# EAGLE design esquema v1 (EAGLE 9.6.2)
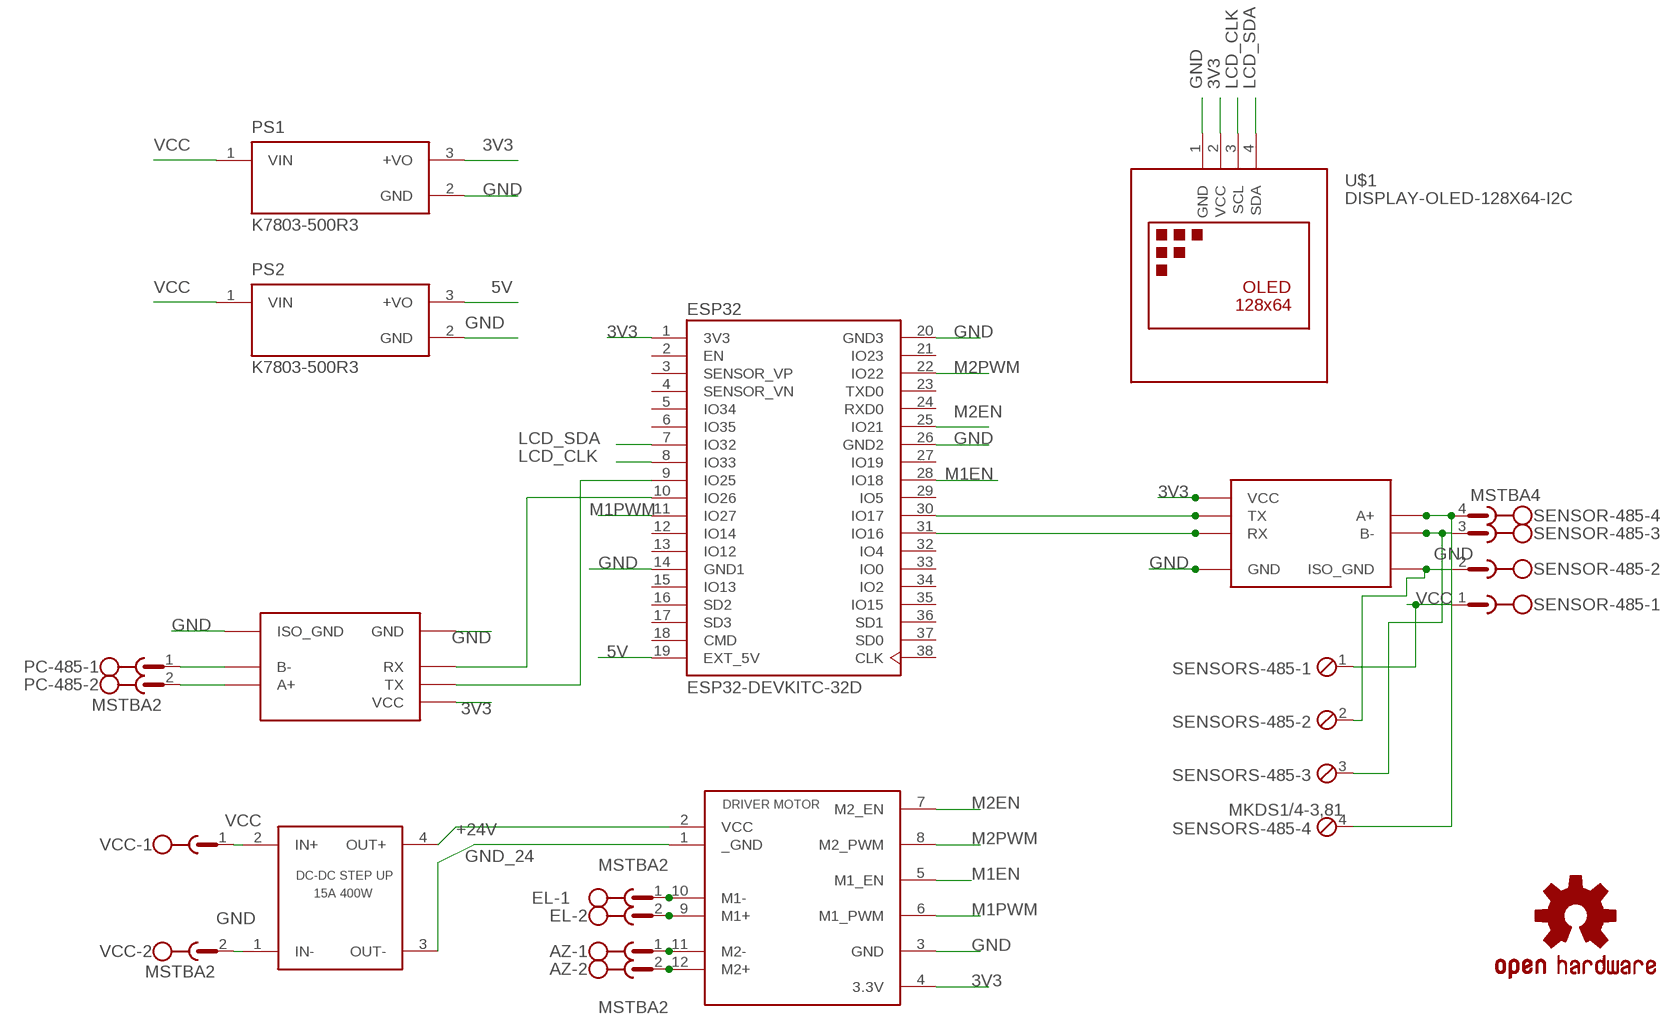
[diagram p0: schematic, sheet 1]

## Parts
AZ  MSTBA2  [MSTBA2]
EL  MSTBA2  [MSTBA2]
ESP32  ESP32-DEVKITC-32D  [MODULE_ESP32-DEVKITC-32D]
LOGO1  OSHW-LOGOMINI  [OSHW-LOGO-MINI]
M1  DRIVER_MOTOR  [DRIVER_MOTOR]
M2  DC-DC_STRP_UP  [DC-DC-SETP-UP]
M3  LIMNOTECH_SMC_RS485  [LIMNOTECH_SMC_RS485]
M4  LIMNOTECH_SMC_RS485  [LIMNOTECH_SMC_RS485]
PC-485  MSTBA2  [MSTBA2]
PS1  K7803-500R3  [CONV_K7803-500R3]
PS2  K7803-500R3  [CONV_K7803-500R3]
SENSOR-485  MSTBA4  [MSTBA4]
SENSORS-485  MKDS1/4-3,81  [4POL381]
U$1  DISPLAY-OLED-128X64-I2C  [DISPLAY-OLED-128X64-I2C]
VCC  MSTBA2  [MSTBA2]

## Nets
3V3: ESP32.1(3V3) M1.4(3.3V) M3.VCC M4.VCC PS1.3(+VO) U$1.2(VCC)
5V: ESP32.19(EXT_5V) PS2.3(+VO)
+24V: M1.2(VCC) M2.4(OUT+)
GND: ESP32.14(GND1) ESP32.20(GND3) ESP32.26(GND2) M1.3(GND) M2.1(IN-) M3.GND M3.GND_ISO(ISO_GND) M4.GND M4.GND_ISO(ISO_GND) PS1.2(GND) PS2.2(GND) SENSOR-485.2 SENSORS-485.2 U$1.1(GND) VCC.2
GND_24: M1.1(_GND) M2.3(OUT-)
LCD_CLK: ESP32.8(IO33) U$1.3(SCL)
LCD_SDA: ESP32.7(IO32) U$1.4(SDA)
M1EN: ESP32.28(IO18) M1.5(M1_EN)
M1PWM: ESP32.11(IO27) M1.6(M1_PWM)
M2EN: ESP32.25(IO21) M1.7(M2_EN)
M2PWM: ESP32.22(IO22) M1.8(M2_PWM)
N$1: M4.B- SENSOR-485.3 SENSORS-485.3
N$2: M4.A+ SENSOR-485.4 SENSORS-485.4
N$3: EL.2 M1.9(M1+)
N$4: AZ.2 M1.12(M2+)
N$5: ESP32.10(IO26) M3.RX
N$6: ESP32.9(IO25) M3.TX
N$7: ESP32.31(IO16) M4.RX
N$8: ESP32.30(IO17) M4.TX
N$9: M3.B- PC-485.1
N$10: M3.A+ PC-485.2
N$11: AZ.1 M1.11(M2-)
N$12: EL.1 M1.10(M1-)
VCC [power]: M2.2(IN+) PS1.1(VIN) PS2.1(VIN) SENSOR-485.1 SENSORS-485.1 VCC.1
Unconnected: ESP32.2(EN) ESP32.3(SENSOR_VP) ESP32.4(SENSOR_VN) ESP32.5(IO34) ESP32.6(IO35) ESP32.12(IO14) ESP32.13(IO12) ESP32.15(IO13) ESP32.16(SD2) ESP32.17(SD3) ESP32.18(CMD) ESP32.21(IO23) ESP32.23(TXD0) ESP32.24(RXD0) ESP32.27(IO19) ESP32.29(IO5) ESP32.32(IO4) ESP32.33(IO0) ESP32.34(IO2) ESP32.35(IO15) ESP32.36(SD1) ESP32.37(SD0) ESP32.38(CLK)

## Library data of the parts
AZ EL PC-485 VCC = con-phoenix-508:MSTBA2: PHOENIX; MF: FARNELL; MPN: 1757242; OC_FARNELL: 3705171; OC_NEWARK: 71C4161
ESP32 = ESP32-DEVKITC-32D:ESP32-DEVKITC-32D: Eval Board For Esp-Wroom-32 Check prices <https://pricing.snapeda.com/parts/ESP32-DEVKITC-32D/Espressif%20Systems/view-part?ref=eda>; AVAILABILITY: Warning; DESCRIPTION: EVAL BOARD FOR ESP-WROOM-32; MF: Espressif Systems; MP: ESP32-DEVKITC-32D; PACKAGE: None; PRICE: None; PURCHASE-URL: https://pricing.snapeda.com/search/part/ESP32-DEVKITC-32D/?ref=eda
LOGO1 = SparkFun-Aesthetics:OSHW-LOGO: Open-Source Hardware (OSHW) Logo This logo indicates the piece of hardware it is found on incorporates a OSHW license and/or adheres to the definition of open source hardware found here: http://freedomdefined.org/OSHW
M1 = aamilibreria:DRIVER_MOTOR
M2 = aamilibreria:DC-DC_STRP_UP
M3 M4 = aamilibreria:LIMNOTECH_SMC_RS485: Layout for connecting SMC RS-485 module Module <https://www.amazon.com/SMAKN%C2%AE-Adapter-Serial-Converter-Module/dp/B010723BCE>
PS1 PS2 = K7803-500R3:K7803-500R3: DC/DC Converter Check availability <https://pricing.snapeda.com/parts/K7803-500R3/Mornsun%20America%2C%20LLC/view-part?ref=eda>; AVAILABILITY: In Stock; DESCRIPTION: Non-Isolated PoL Module DC DC Converter 1 Output 3.3V, -3.3V - - - 500mA, 300mA 4.75V, 7V - 36V, 32V Input; MF: Mornsun America, LLC; MP: K7803-500R3; PACKAGE: SIP-3-3 MORNSUN; PRICE: None; PURCHASE-URL: https://pricing.snapeda.com/search/part/K7803-500R3/?ref=eda
SENSOR-485 = con-phoenix-508:MSTBA4: PHOENIX; MF: FARNELL; MPN: 1757268; OC_FARNELL: 3705195; OC_NEWARK: 71C4163
SENSORS-485 = con-phoenix-381:MKDS1/4-3,81: MKDS 1/4-3,81 - Order No. 1727036 Pitch: 3,81mm Number of terminals: 4 Rated Voltage: 160V Maximum load current/ cross section: 12A/1.5mm2-AWG16 Housing Interlocking: none Color: Green
U$1 = diy-modules:DISPLAY-OLED-128X64-I2C: 128x64 Dot Matrix OLED Module based on SSD1306 chip Variant with I2C interface More details available here: http://www.instructables.com/id/Monochrome-096-i2c-OLED-display-with-arduino-SSD13/ SSD1306 datasheet: https://cdn-shop.adafruit.com/datasheets/SSD1306.pdf Click here to find device on ebay.com <http://www.ebay.com/sch/oled+display+128x64+iic> Note: There are two variants: I2C and SPI. Search for the proper version.

## Net classes
0 default: width 0.5 mm, drill 0.5 mm, clearance 0.8 mm
1 power: width 1 mm, clearance 1 mm

## Board
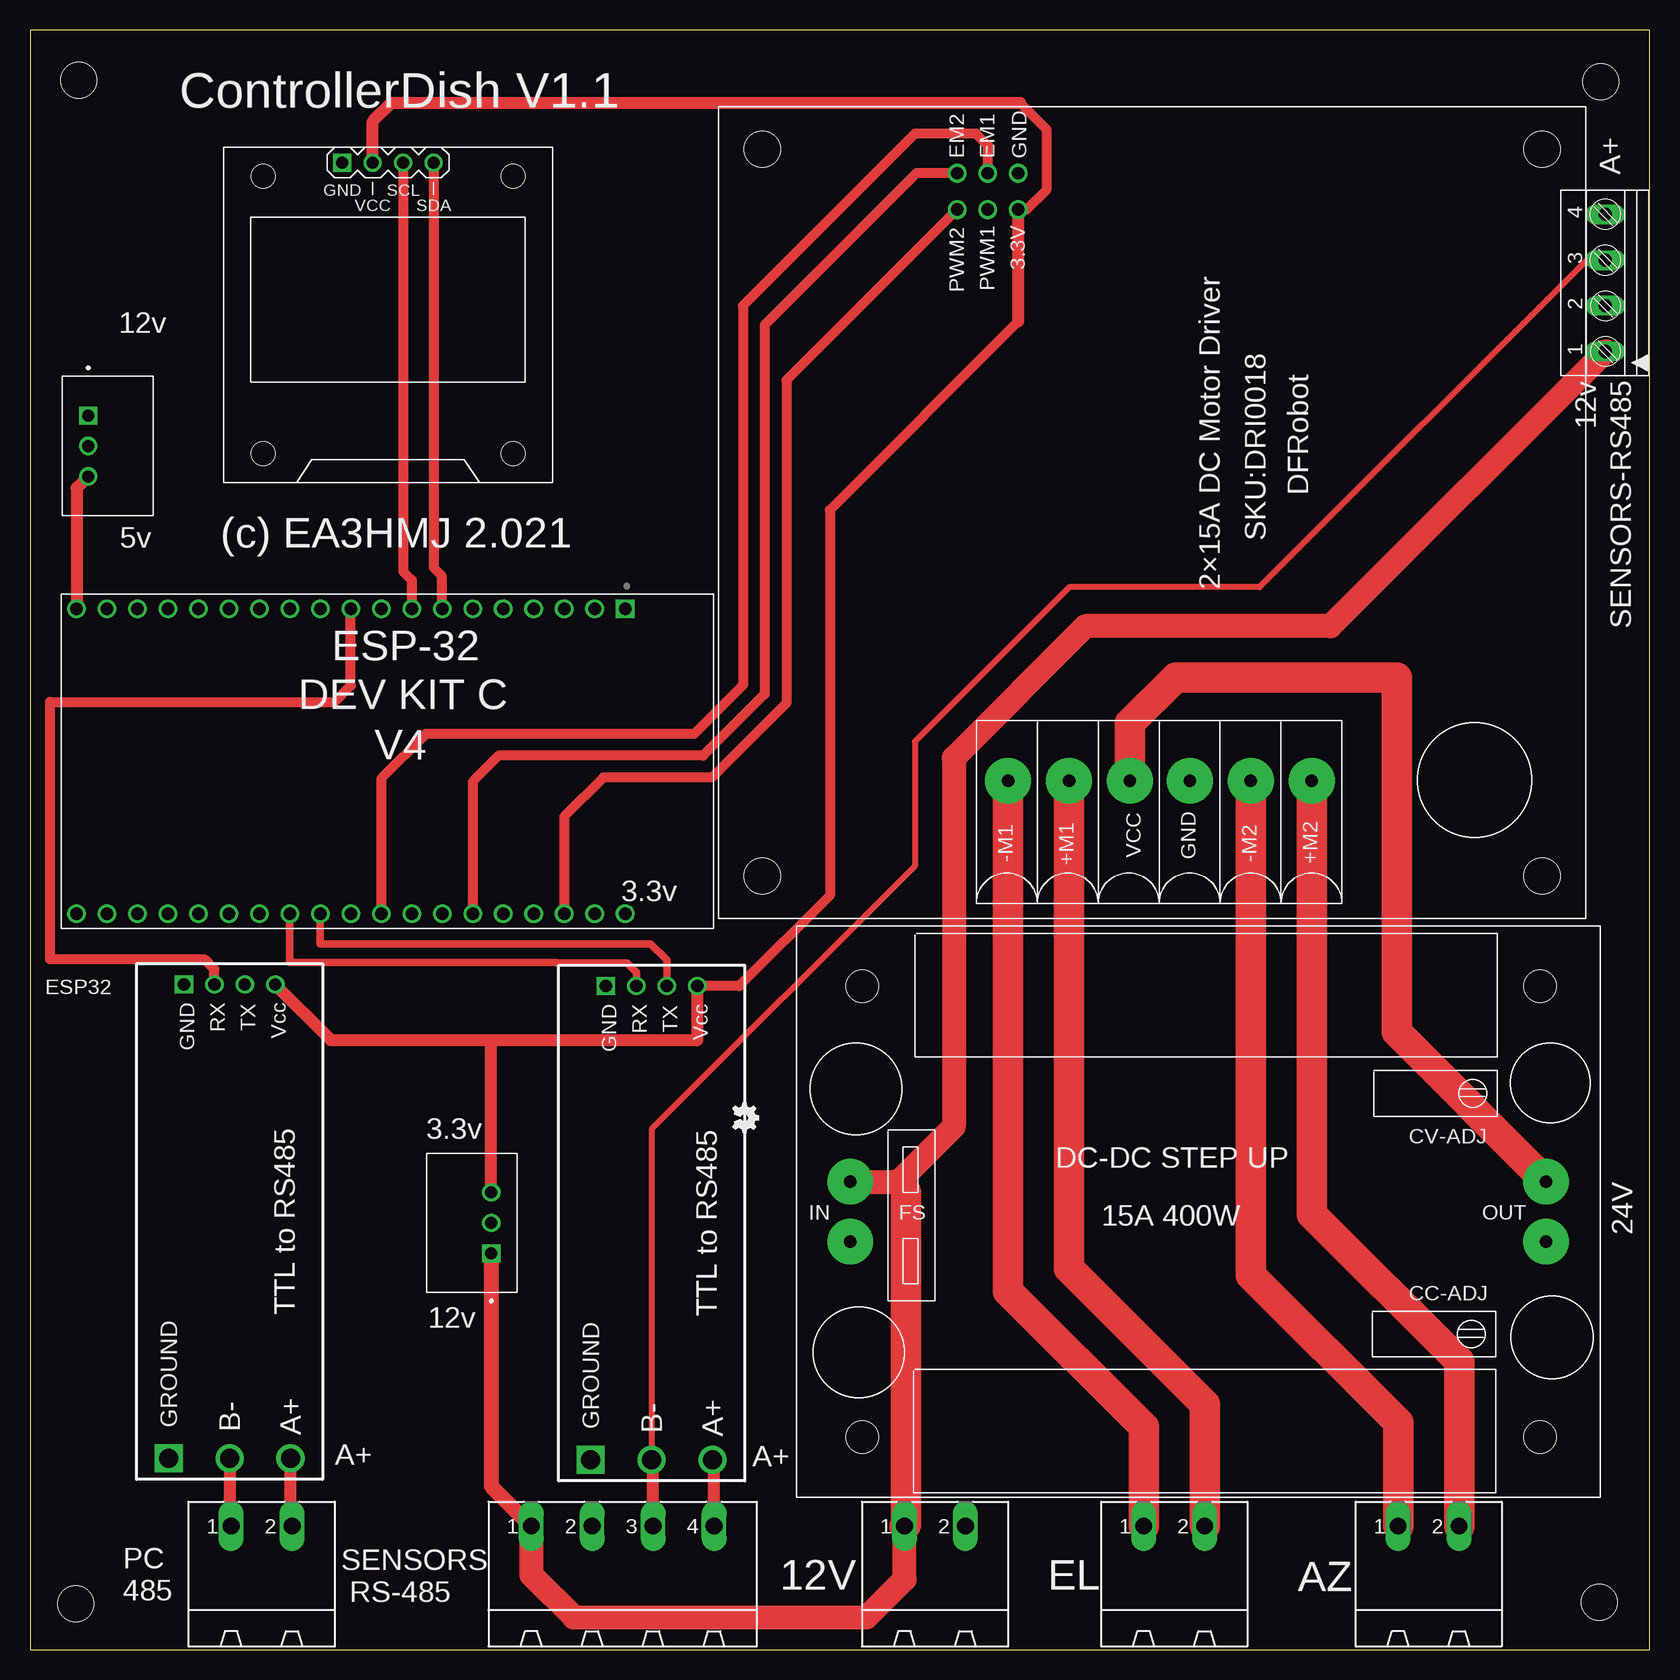
[diagram p1: board, top side]
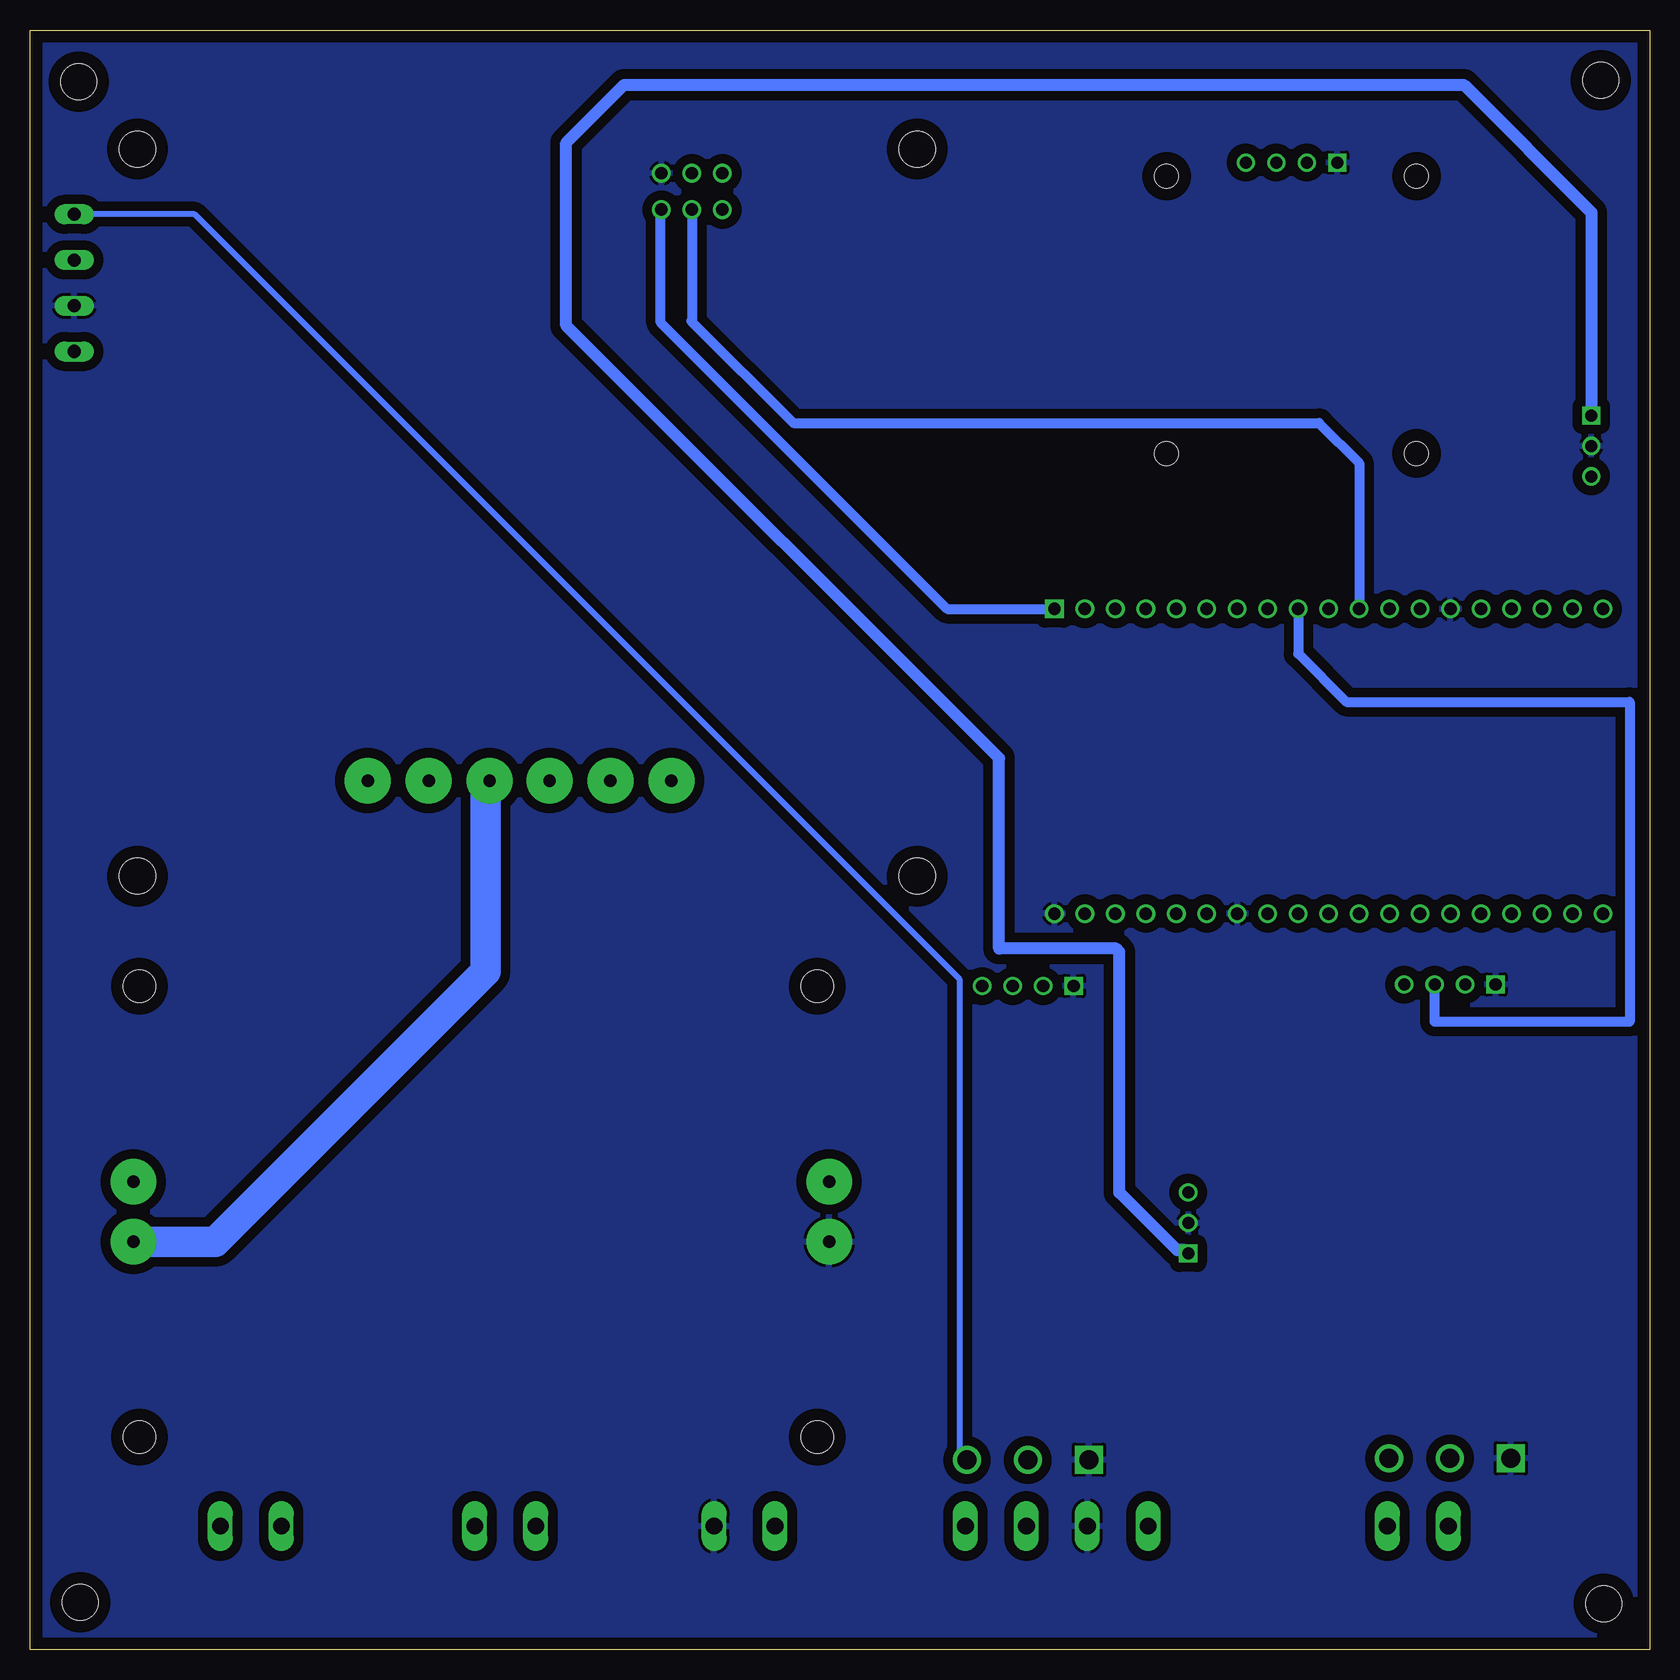
[diagram p2: board, bottom side, seen from below]

Size 135 x 135 mm. Coordinates in mm from the lower left corner, seen from the top.
Outline: 0,135 0,0 135,0 135,135 0,135
Copper layers (1*16): Top 0.035mm / dielectric 1.5mm / Bottom 0.035mm
Design rules "default": minimum track width 6mil, minimum drill 0.35mm, track to track 6mil, track to pad 6mil, pad to pad 6mil, via to via 6mil, smd to smd 6mil, copper to edge 40mil, drill to drill 6mil, minimum pad ring 10mil, minimum via ring 8mil, stop-mask expansion 4mil, vias tented up to drill 0mil, thermal gap 10mil
Holes 3 mm at 3.81,3.81 4.06,130.81 130.81,3.94 130.94,130.68

### Footprints (pad centres in the part's own frame; a part is rotated, then mirrored left to right if it is on the bottom)
MSTBA2 = drill 1.397 long: 1 -2.54,5.08; 2 2.54,5.08
MODULE_ESP32-DEVKITC-32D = drill 1.04 square: 1 -12.7,19.76 | drill 1.04: 2 -12.7,17.22; 3 -12.7,14.68; 4 -12.7,12.14; 5 -12.7,9.6; 6 -12.7,7.06; 7 -12.7,4.52; 8 -12.7,1.98; 9 -12.7,-0.56; 10 -12.7,-3.1; 11 -12.7,-5.64; 12 -12.7,-8.18; 13 -12.7,-10.72; 14 -12.7,-13.26; 15 -12.7,-15.8; 16 -12.7,-18.34; 17 -12.7,-20.88; 18 -12.7,-23.42; 19 -12.7,-25.96; 20 12.7,19.76; 21 12.7,17.22; 22 12.7,14.68; 23 12.7,12.14; 24 12.7,9.6; 25 12.7,7.06; 26 12.7,4.52; 27 12.7,1.98; 28 12.7,-0.56; 29 12.7,-3.1; 30 12.7,-5.64; 31 12.7,-8.18; 32 12.7,-10.72; 33 12.7,-13.26; 34 12.7,-15.8; 35 12.7,-18.34; 36 12.7,-20.88; 37 12.7,-23.42; 38 12.7,-25.96
DRIVER_MOTOR = drill 1.04 pad 3.81: 1 11.5,33; 2 11.5,38; 9 11.5,43.08; 10 11.5,48.16; 11 11.5,27.92; 12 11.5,22.84 | drill 1.04: 3 62.14,47.32; 4 59.1,47.32; 5 62.14,49.86; 6 59.1,49.86; 7 62.14,52.4; 8 59.1,52.4 | hole 3: 3.55,68.65; 64.15,68.65; 64.15,3.65; 3.55,3.65
DC-DC-SETP-UP = drill 1.04 pad 3.81: 1 4.5,21.3; 2 4.5,26.3; 3 62.5,21.3; 4 62.5,26.3 | hole 2.7: 5.5,5; 5.5,42.6; 62,42.6; 62,5
LIMNOTECH_SMC_RS485 = drill 1.57: A+ 19.75,5.08; B- 19.75,0 | drill 1.016 square: GND -19.75,-3.81 | drill 1.57 square: GND_ISO 19.75,-5.08 | drill 1.016: RX -19.75,-1.27; TX -19.75,1.27; VCC -19.75,3.81
CONV_K7803-500R3 = drill 1 square: 1 -2.54,-1.625 | drill 1: 2 0,-1.625; 3 2.54,-1.625
MSTBA4 = drill 1.397 long: 1 -7.62,5.08; 2 -2.54,5.08; 3 2.54,5.08; 4 7.62,5.08
4POL381 = drill 1.1 long: 1 0,0; 2 3.81,0; 3 7.62,0; 4 11.43,0
DISPLAY-OLED-128X64-I2C = drill 1 square: 1 -3.81,12.7 | drill 1: 2 -1.27,12.7; 3 1.27,12.7; 4 3.81,12.7 | hole 2: -10.414,11.557; 10.414,11.557; 10.414,-11.557; -10.414,-11.557

### Placement (x,y rotation side)
AZ  116.59,5.21 0 top
EL  95.38,5.21 0 top
ESP32  29.84,74.04 270 top
LOGO1  59.56,44.32 270 top
M1  129.69,60.92 90 top
M2  63.88,12.7 0 top
M3  16.64,35.69 270 top
M4  51.82,35.56 270 top
PC-485  19.3,5.21 0 top
PS1  36.83,35.56 90 top
PS2  6.48,100.33 270 top
SENSOR-485  49.4,5.21 0 top
SENSORS-485  131.32,108.2 90 top
U$1  29.84,111.25 0 top
VCC  75.44,5.21 0 top

### Tracks (layer width: path | path; a pad name or v marks a point on that pad's centre or on a via)
3V3
  Top 0.813: 82.37,110.69 66.67,95 66.67,62.87 59.12,55.31 M4.VCC | 82.55,128.91 84.71,126.75 84.71,121.67 83.07,120.02 M1.4
  Top 1.016: M4.VCC 55.63,50.8 38.45,50.8 | M3.VCC 25.08,50.8 38.45,50.8 | M1.4 82.37,110.69 | 82.55,128.91 30.1,128.91 28.57,127.38 U$1.2 | PS1.3 38.45,50.8
  Bottom 0.813: ESP32.1 58.55,86.74 82.42,110.62 82.42,119.97 M1.4
5V
  Top 1.016: PS2.3 3.88,96.82 ESP32.19
+24V
  Top 2.54: M2.4 113.92,51.46 113.92,81.03 95.5,81.03 91.69,77.21 M1.2
GND
  pour Bottom: -1.27,141.35 140.21,141.35 140.21,0.13 -1.27,0.13
GND_24
  Bottom 2.54: M2.3 119.54,34 97.03,56.52 97.03,72.08 M1.1
LCD_CLK
  Top 0.813: U$1.3 31.11,89.87 31.82,89.15 ESP32.8
LCD_SDA
  Top 0.813: ESP32.7 34.3,86.81 34.3,89.53 33.66,90.17 U$1.4
M1EN
  Top 0.813: M1.5 79.85,123.09 79.85,125.37 78.86,126.36 73.79,126.36 59.44,112.01 59.44,80.39 55.37,76.33 33.02,76.33 29.29,72.59 ESP32.28
M1PWM
  Bottom 0.813: M1.6 79.83,110.8 79.88,110.74 71.37,102.23 27.56,102.23 24.2,98.88 ESP32.11
M2EN
  Top 0.813: M1.7 73.91,123.06 61.25,110.4 61.25,79.64 56.12,74.51 39.08,74.51 36.91,72.34 ESP32.25
M2PWM
  Top 0.813: M1.8 63.06,105.8 63.06,78.89 56.87,72.7 47.81,72.7 44.52,69.42 ESP32.22
N$1
  Top 0.5: M4.B- 51.82,43.38 73.75,65.32 73.75,75.67 86.62,88.55 102.5,88.55 129.77,115.82 SENSORS-485.3
  Top 1.016: SENSOR-485.3 51.94,15.68 M4.B-
N$2
  Top 1.016: SENSOR-485.4 57.02,15.68 M4.A+
  Bottom 0.5: M4.A+ 57.53,16.45 57.53,55.88 121.28,119.63 SENSORS-485.4
N$3
  Top 2.54: M1.9 86.61,31.76 97.92,20.45 EL.2
N$4
  Top 2.54: M1.12 106.85,36.28 119.13,24 AZ.2
N$5
  Top 0.813: M3.RX 15.37,56.71 14.54,57.53 1.68,57.53 1.68,78.99 25.4,78.99 26.75,80.34 ESP32.10
N$6
  Bottom 0.813: ESP32.9 29.29,83.01 25.27,78.99 1.65,78.99 1.65,52.32 17.91,52.32 M3.TX
N$7
  Top 0.61: M4.RX 50.55,56.45 49.78,57.22 43.88,57.22 43.81,57.28 21.66,57.28 ESP32.31
N$8
  Top 0.61: ESP32.30 24.2,58.81 51.74,58.81 53.09,57.47 M4.TX
N$9
  Top 1.016: M3.B- 16.64,10.41 PC-485.1
N$10
  Top 1.016: PC-485.2 21.72,10.41 M3.A+
N$11
  Top 2.54: M1.11 101.77,31.2 114.05,18.92 AZ.1
N$12
  Top 2.54: M1.10 81.53,29.85 92.84,18.54 EL.1
VCC
  Top 1.27: PS1.1 38.45,13.62 SENSOR-485.1
  Top 2: SENSORS-485.1 108.41,85.3 87.97,85.3 77,74.33 77,43.6 72.26,38.86 | SENSOR-485.1 41.78,6.22 45.34,2.67 69.72,2.67 72.9,5.84 VCC.1 | 73.03,38.1 72.26,38.86 | M2.2 72.12,39 72.26,38.86
  Top 2.54: 73.03,38.1 73.03,10.41 VCC.1
  Bottom 1.016: PS1.1 38.73,33.3 39.39,33.3 44.2,38.1 44.2,58.17 44.45,58.42 54.23,58.42 54.23,74.3 90.3,110.36 90.3,125.6 85.47,130.43 15.49,130.43 4.85,119.79 PS2.1

### Text on the board
tNames: ControllerDish V1.1 | A+ | 12v | 12v | 5v | (c) EA3HMJ 2.021 | SENSORS-RS485 | ESP-32 | DEV KIT C | V4 | 3.3v | 3.3v | 24V | 12v | A+ | A+ | 12V | PC / 485 | SENSORS / RS-485